# EasyEDA schematic SCH_music-pad_2026-02-09.json
TITLE: Sheet_1; REV: 1.0; Date: 2026-01-11; Sheet: 1/1; Drawn By: ludoguillain; Company: Your Company
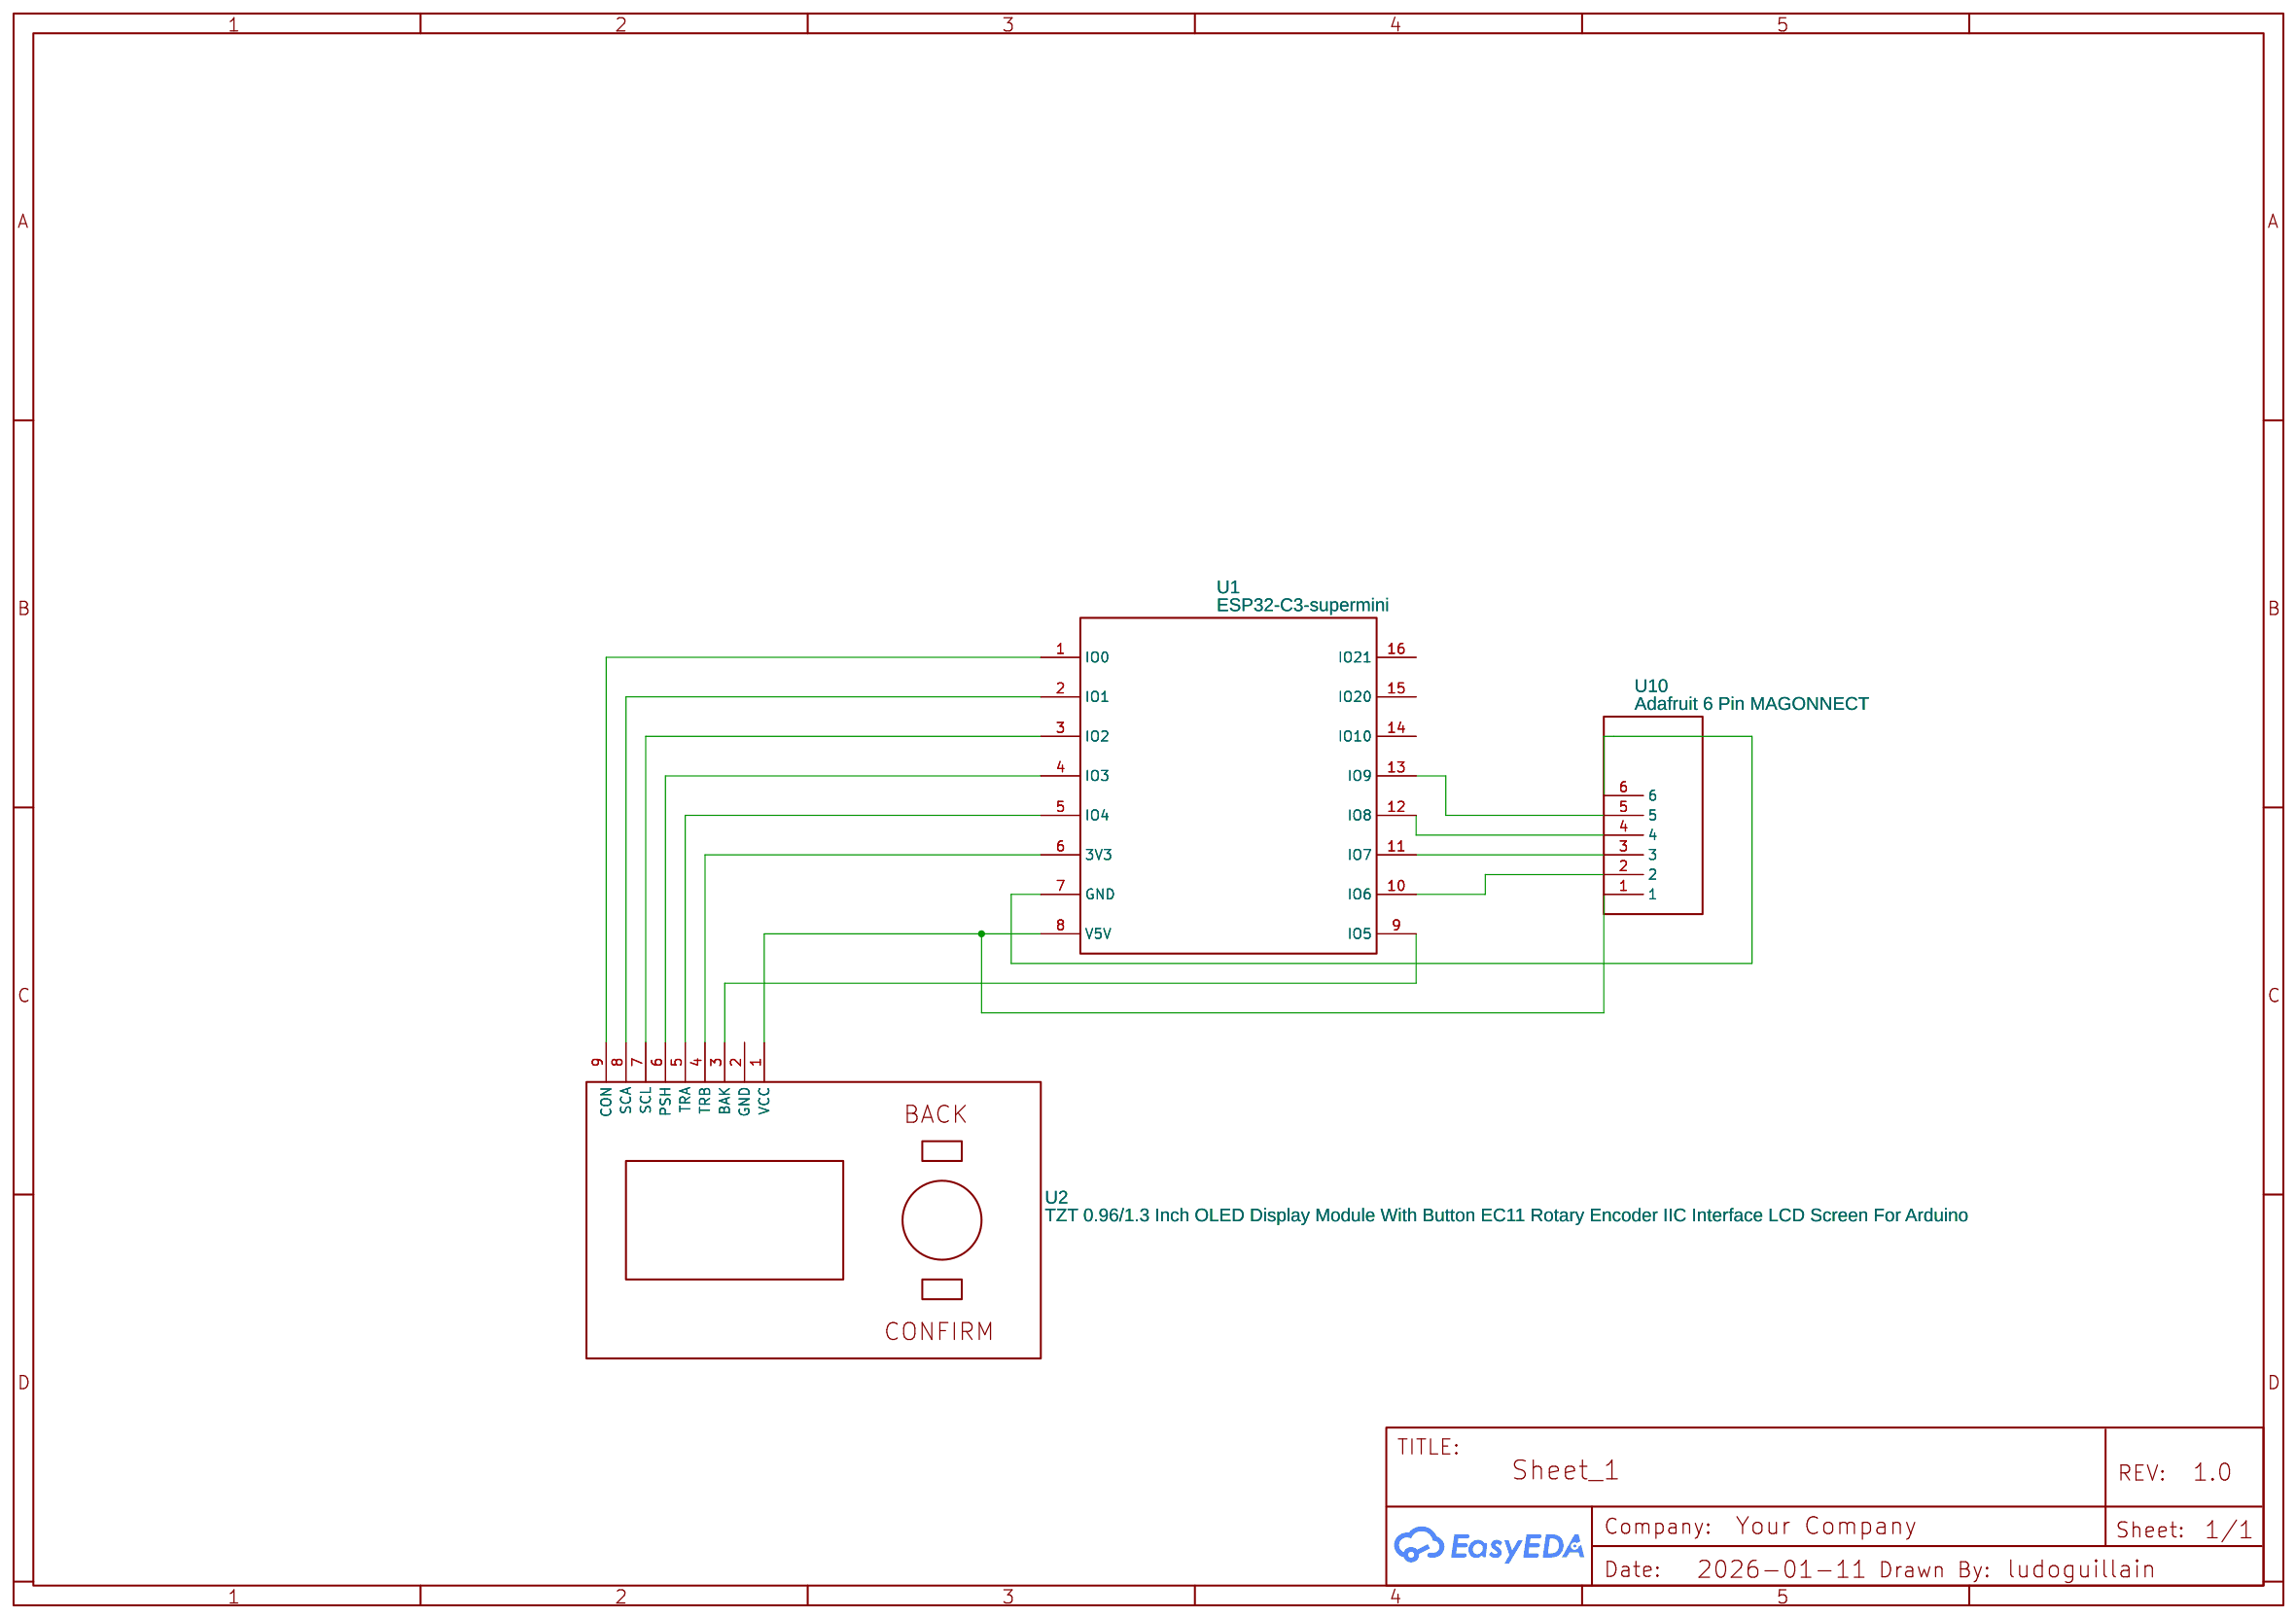
[diagram p0: schematic sheet]

## Parts
U1  ESP32-C3-supermini  [ESP32-C3-SUPERMINI]
U2  TZT 0.96/1.3 Inch OLED Display Module With Button EC11 Rotary Encoder IIC Interface LCD Screen For Arduino  [PIN_HEADERS:PIN_HEADER_ANGLED_1X10_PITCH2.54MM]
U10  Adafruit 6 Pin MAGONNECT  [MAGNETIC CONNECTOR 9PIN]

## Library data of the parts
U1 = ESP32-C3-supermini: Contributor: Guest
U2 = TZT 0.96/1.3 Inch OLED Display Module With Button EC11 Rotary Encoder IIC Interface LCD Screen For Arduino: Manufacturer: TZT; Manufacturer Part: 8256; Supplier: TZT; Supplier Part: 8256; link: https://www.tztstore.com/goods/show-8256.html; Contributor: aathish04
U10 = Adafruit 6 Pin MAGONNECT: Contributor: rmccullough3000

## Nets
Net-(U1-1): U1.1(IO0) U2.9(CON)
Net-(U1-2): U1.2(IO1) U2.8(SCA)
Net-(U1-3): U1.3(IO2) U2.7(SCL)
Net-(U1-4): U1.4(IO3) U2.6(PSH)
Net-(U1-5): U1.5(IO4) U2.5(TRA)
Net-(U1-6): U1.6(3V3) U2.4(TRB)
Net-(U1-7): U1.7(GND) U10.6
Net-(U1-8): U1.8(V5V) U2.1(VCC) U10.1
Net-(U1-9): U1.9(IO5) U2.3(BAK)
Net-(U1-10): U1.10(IO6) U10.2
Net-(U1-11): U1.11(IO7) U10.3
Net-(U1-12): U1.12(IO8) U10.4
Net-(U1-13): U1.13(IO9) U10.5

Not connected (* = marked no-connect by the designer): U1 14(IO10) 15(IO20) 16(IO21); U2 2(GND)
